# Altium schematic sheet Jetson_power.SchDoc
size A; SheetNumber: 3; SheetTotal: 3
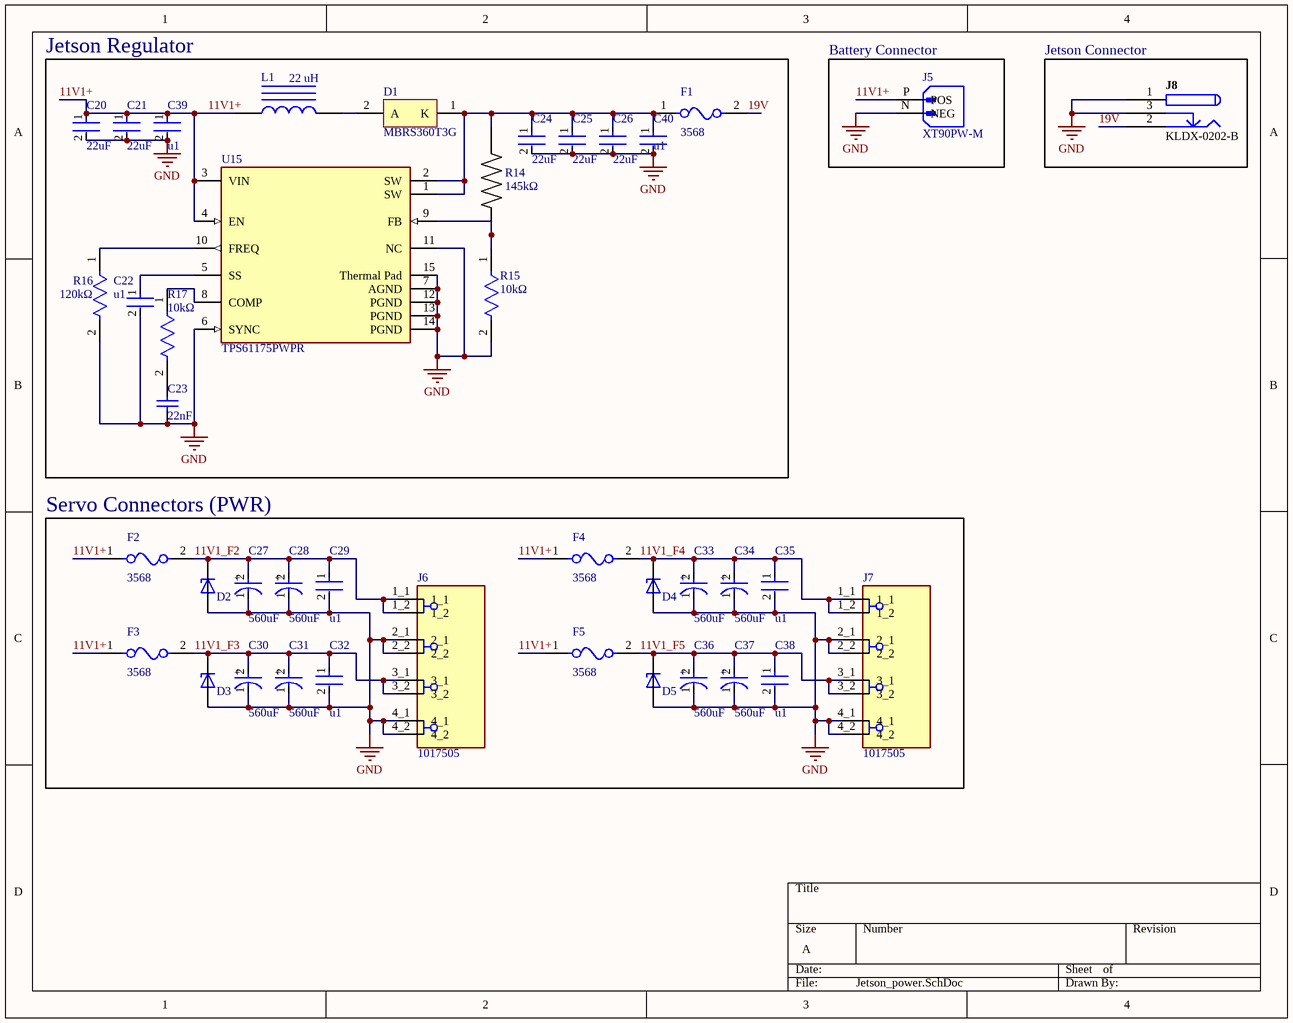
[diagram p0: Jetson_power.SchDoc]

## Parts
C20  22uF  [FP-CGA9P-MFG]
C21  22uF  [FP-CGA9P-MFG]
C22  u1  [FP-CC0805-0_85-MFG]
C23  22nF  [CAPC2013X94X50ML20T25]
C24  22uF  [FP-CGA9P-MFG]
C25  22uF  [FP-CGA9P-MFG]
C26  22uF  [FP-CGA9P-MFG]
C27  560uF  [FP-OS-CON-TH-E12-d_0_6-MFG]
C28  560uF  [FP-OS-CON-TH-E12-d_0_6-MFG]
C29  u1  [FP-CC0805-0_85-MFG]
C30  560uF  [FP-OS-CON-TH-E12-d_0_6-MFG]
C31  560uF  [FP-OS-CON-TH-E12-d_0_6-MFG]
C32  u1  [FP-CC0805-0_85-MFG]
C33  560uF  [FP-OS-CON-TH-E12-d_0_6-MFG]
C34  560uF  [FP-OS-CON-TH-E12-d_0_6-MFG]
C35  u1  [FP-CC0805-0_85-MFG]
C36  560uF  [FP-OS-CON-TH-E12-d_0_6-MFG]
C37  560uF  [FP-OS-CON-TH-E12-d_0_6-MFG]
C38  u1  [FP-CC0805-0_85-MFG]
C39  u1  [FP-CC0805-0_85-MFG]
C40  u1  [FP-CC0805-0_85-MFG]
D1  MBRS360T3G  [ONSC-SMC-2-403-03_V]
D2  SMBJ13A-13-F  [DIOM5336X250N]  (value not drawn)
D3  SMBJ13A-13-F  [DIOM5336X250N]  (value not drawn)
D4  SMBJ13A-13-F  [DIOM5336X250N]  (value not drawn)
D5  SMBJ13A-13-F  [DIOM5336X250N]  (value not drawn)
F1  3568  [FP-3568-MFG]
F2  3568  [FP-3568-MFG]
F3  3568  [FP-3568-MFG]
F4  3568  [FP-3568-MFG]
F5  3568  [FP-3568-MFG]
J5  XT90PW-M  [AMASS_XT90PW-M - duplicate]
J6  1017505  [PHOENIX_1017505]
J7  1017505  [PHOENIX_1017505]
J8  KLDX-0202-B  [KYCN-KLDX-0202-B_V]
L1  22 uH  [COIL-MSS1038_V]
R14  145kΩ  [*RESC2012X60N]
R15  10kΩ  [FP-RNCP0805-IPC_C]
R16  120kΩ  [FP-RMCF0603-IPC_A]
R17  10kΩ  [FP-RNCP0805-IPC_C]
U15  TPS61175PWPR  [FP-PWP0014E-MFG]

## Blocks framed on the sheet
Jetson Regulator: C20-C26 C39 C40 D1 F1 L1 R14-R17 U15
Battery Connector: J5
Jetson Connector: J8
Servo Connectors (PWR): C27-C38 D2-D5 F2-F5 J6 J7

## Nets
GND: C20.2 C21.2 C22.2 C23.1 C24.2 C25.2 C26.2 C27.1(C) C28.1(C) C29.2 C30.1(C) C31.1(C) C32.2 C33.1(C) C34.1(C) C35.2 C36.1(C) C37.1(C) C38.2 C39.2 C40.2 D2.2(A) D3.2(A) D4.2(A) D5.2(A) J5.N(NEG) J6.2_1 J6.2_2 J6.4_1 J6.4_2 J7.2_1 J7.2_2 J7.4_1 J7.4_2 J8.1 J8.3 R15.2 R16.2 U15.6(SYNC) U15.7(AGND) U15.11(NC) U15.12(PGND) U15.13(PGND) U15.14(PGND) U15.15(Thermal_Pad)
11V1+: C20.1 C21.1 C39.1 F2.1 F3.1 F4.1 F5.1 J5.P(POS) L1.1 U15.3(VIN) U15.4(EN)
11V1_F2: C27.2(A) C28.2(A) C29.1 D2.1(C) F2.2 J6.1_1 J6.1_2
11V1_F3: C30.2(A) C31.2(A) C32.1 D3.1(C) F3.2 J6.3_1 J6.3_2
11V1_F4: C33.2(A) C34.2(A) C35.1 D4.1(C) F4.2 J7.1_1 J7.1_2
11V1_F5: C36.2(A) C37.2(A) C38.1 D5.1(C) F5.2 J7.3_1 J7.3_2
19V: F1.2 J8.2
NetC22_1: C22.1 U15.5(SS)
NetC23_2: C23.2 R17.2
NetC24_1: C24.1 C25.1 C26.1 C40.1 D1.1(K) F1.1 R14.1 U15.1(SW) U15.2(SW)
NetD1_2: D1.2(A) L1.2
NetR14_2: R14.2 R15.1 U15.9(FB)
NetR16_1: R16.1 U15.10(FREQ)
NetR17_1: R17.1 U15.8(COMP)

## Notes on the sheet
- (in symbol CMP-05428-001250-1) +

## Library data of the parts
C20 C21 C24-C26 = CMP-08246-000043-1: CAP 2220 X7R 50V 22UF 20% 2.50MM CGA9P3X7R1H226M250KB
C22 C29 C32 C35 C38-C40 = CMP-2100-03606-3: CC0805KRX7R9BB104 CAP CER 0.1UF 50V X7R 0805; Manufacturer: Yageo; Tolerance: 0.1; Capacitance: 100 nF; Value: 100 nF; Material: Ceramic; Device Class L1: Passive Components; ComponentLink2Description: Datasheet; Package: CC0805-0.85; Manufacturer Part Number: CC0805KRX7R9BB104; Digikey Description: CAP CER 0.1UF 50V X7R 0805; Device Class L3: Ceramic Capacitors; Temperature: -30°C to +85°C; Temperature Characteristic: X7R; Voltage Rating: 50 V; Height: 0.95mm; RoHS: TRUE; Ipc Land Pattern Name: CAPC200125X85; Device Class L2: Capacitors; Category: Cap; Temperature Range Low: -30°C; Temperature Range High: +85°C; Mouser Description: Multilayer Ceramic Capacitors MLCC - SMD/SMT 100nF 50V X7R 10%; Footprint Url: http://www.yageo.com/exep/pages/download/literatures/UPY-C_GEN_24.pdf; Automotive: No; Octopart: https://octopart.com/cc0805krx7r9bb104-yageo-192993; Lead Free: Yes; ComponentLink2URL: http://www.yageo.com/documents/recent/UPY-GPHC_Y5V_6.3V-to-50V_8.pdf
C23 = CMP-2007-04398-1: 08055C223KAZ2A; Manufacturer: AVX Interconnect / Elco; Part Number: 08055C223KAZ2A
C27 C28 C30 C31 C33 C34 C36 C37 = CMP-05428-001250-1: Conductive Polymer Aluminum Solid Capacitors (OS-CON) 560uF ±20% 16V RADIAL TH 8x12mm 16SEPF560M; ESR (Equivalent Series Resistance): 14mR; Leakage Current: 1.792mA; Life (Hours): 5000Hour; Lead Diameter: 0.6mm; Dissipation Factor: 12%; Ripple Current: 4.95A; Polarity: Polar; RoHS Compliant: Yes; Length: 12mm; Series: OS-CON™, SEPF; Min Operating Temperature: -55°C; Construction: RADIAL; Tolerance: 20%; Capacitance: 560uF; Height: 12mm; Termination: Radial; Max Operating Temperature: 105°C; Number of Pins: 12; Diameter: 8mm; Lead Free: Lead Free; Lead Pitch: 3.5mm; Mount: Through Hole; Height - Seated (Max): 0.472inch; Package Quantity: 200; REACH SVHC: No SVHC; Voltage: 16V; Voltage Rating: 16V; Packaging: Bulk; Case/Package: Radial; Voltage Rating (DC): 16V
D1 = CMP-1055-00394-1: Schottky Power Rectifier, 2-Pin SMC, Pb-Free, Tape and Reel; Manufacturer: On Semiconductor; Configuration: Single; IFSM Max (A): 125; Packing: Tape and Reel; DatasheetVersion: Rev. 8; PackageReference: SMC-2-403-03; Mounting Technology: Surface Mount; ComponentLink2Description: Datasheet; ComponentLink2URL: http://www.onsemi.cn/pub_link/Collateral/MBRS360T3-D.PDF; PartNumber: MBRS360T3G; ComponentLink1Description: Manufacturer URL; ComponentLink3Description: Package Specification; PackageDescription: 2-Pin Small Molded Package, J-Bend Lead, Body 5.845 x 6.855 mm; ComponentLink1URL: http://www.onsemi.com/; PackageVersion: Rev. E, 08/2005; RoHS: TRUE; ComponentLink3URL: http://www.onsemi.com/pub_link/Collateral/403-03.PDF
D2-D5 = CMP-004-00032-1: 400 W 13 V Uni-Directional SMT Transient Voltage Suppressor Diode - DO-214AA; MF: Diodes Inc.; Component Type: Standard; Value: *; Case/Package: DO-214 Diodes Inc.; SnapEDA_Link: https://www.snapeda.com/parts/SMBJ13A-13-F/Diodes+Inc./view-part/?ref=snap; Check_prices: https://www.snapeda.com/parts/SMBJ13A-13-F/Diodes+Inc./view-part/?ref=eda; Design Item ID: SMBJ13A-13-F; Pins: 2; Source: SMBJ13A-13-F.SchLib; MP: SMBJ13A-13-F
F1-F5 = CMP-2000-05464-2: NexarPartId: 8116161; Approvals: UL; Body Material: Nylon; Illumination Type: Illuminated; Voltage Rating (AC): 500V; Current Rating: 20A; Number of Poles: 1; Color: Black; Material: Brass, Nylon, Tin; Depth: 6.73mm; Max Operating Temperature: 145°C; Length: 16mm; Mount: PCB, Vertical; REACH SVHC: No SVHC; Lead Free: Lead Free; Min Operating Temperature: -50°C; Flammability Rating: UL94 V-0; RoHS: Compliant; Orientation: Vertical; Fuse Current: 20A; Termination: PC Pin; Number of Circuits: 1; Contact Plating: Tin; Voltage: 500V; Contact Material: Brass
J5 = XT90PW-M: Socket; DC supply; XT90; male; PIN: 2; on PCBs; THT; Colour: yellow; MF: AMASS; SnapEDA_Link: https://www.snapeda.com/parts/XT90PW-M/AMASS/view-part/?ref=snap; Package: Package; Value: *; MP: XT90PW-M; Check_prices: https://www.snapeda.com/parts/XT90PW-M/AMASS/view-part/?ref=eda
J6 J7 = CMP-011-000000-2: MF: {'manufacturer': u'Phoenix Contact'}; Source: 1017505.SchLib; Price: None; MP: 1017505; Package: None; Component Type: Standard; Availability: Unavailable; Design Item ID: 1017505; Pin Count: 8; Value: *
J8 = CMP-0256-00001-1: 3 Conductor Power Jack, 2 break 2 aux contacts; ComponentLink2URL: http://anacapa.kycon.com/Catalog_PDF/KLDX_0202.pdf; PackageReference: KLDX-0202-B; Contact Finish: Brass; ComponentLink2Description: Datasheet; Mounting Technology: Through Hole; PackageDescription: Jack, 9 x 14.5 mm Body, 2.5 mm Center Pin Diameter; ComponentLink1Description: Manufacturer URL; PartNumber: KLDX-0202-B; ComponentLink1URL: http://kycon.com/
L1 = CMP-2000-06765-1: XAL7070; Case Length: 10.5mm; Shielding: Shielded; Maximum DC Resistance: 50mOhms; Core Material: Ferrite; Self Resonant Frequency: 21MHz; Tolerance: 20%; Test Frequency: 100kHz; Brand: Coilcraft; Case Height: 4mm; Maximum DC Current: 3.8A; Case Width: 10.2mm; Inductance: 15uH; Factory Pack Quantity: 250; Manufacturer URL: http://www.coilcraft.com/; Datasheet Version: 09/2016; Product: PowerInductors; Packaging: Reel; Product Category: FixedInductors; Package Description: 2-Pin Surface Mounted Device , Body 10 x 10 mm; RoHS: Details; Mounting Technology: SurfaceMount; Dimensions: 10.2mmWx10.5mmLx4mmH; Series: MSS1038; Termination Style: SMD/SMT; Datasheet URL: http://www.coilcraft.com/pdfs/mss1038.pdf; Manufacturer: Coilcraft; Package Reference: MSS1038; Operating Temperature Range: -40Cto+125C
R14 = RN73H2ATTD1453B25: SnapEDA_Link: https://www.snapeda.com/parts/RN73H2ATTD1453B25/KOA+Speer/view-part/?ref=snap; Check_prices: https://www.snapeda.com/parts/RN73H2ATTD1453B25/KOA+Speer/view-part/?ref=eda; Value: *
R15 R17 = CMP-26527-007436-1: 10kΩ ±1% 0.25W 0805 High Power Anti-Sulfur Thin Film Chip Resistor RNCP0805FTD10K0; Resistance: 10kR; Max Power Dissipation: 250mW; Temperature Coefficient: 100ppm/°C; Number of Terminations: 2; Length: 0.079inch; Case Code (Metric): 2012; Mount: Surface Mount; Resistor Type: Thin Film; Packaging: Tape and Reel; Tolerance: 1%; RoHS Compliant: Yes; Case Code (Imperial): 0805; Min Operating Temperature: -55°C; Max Operating Temperature: 155°C; Features: Moisture Resistant; Series: RNCP; Case/Package: 0805; Width: 0.049inch; Lead Free: Lead Free; Height: 0.024inch
R16 = CMP-26527-001149-1: 120kΩ ±1% 0.1W 0603 Thick Film Chip Resistor AEC-Q200 compliant RMCF0603FG120K; Resistance: 120kR; Temperature Coefficient: 100ppm/°C; Radiation Hardening: No; Tolerance: 1%; Mount: Surface Mount; Min Operating Temperature: -55°C; Max Operating Temperature: 155°C; Packaging: Tape and Reel; Contact Plating: Tin; Resistor Type: Thick Film; Case/Package: 0603
U15 = CMP-04918-000064-1: IC REG MULT CONFIG ADJ 14HTSSOP; Manufacturer: Texas Instruments; Switching Frequency: 200-2200kHz; Nominal Supply Current: 3.5mA; Max Junction Temp: +125°C; Standoff Height: 0.05mm; Output Voltage: 2.9-38V; Min Supply Voltage: 2.9V; Output Current: 3A; Max Duty Cycle: 93%; Number Of Outputs: 1; Max Supply Voltage: 18V; Switching Topology: Boost,Flyback,Other; Output Type: AdjustableProgrammable; Mouser Description: Voltage Regulators - Switching Regulators 3A High Vltg Boost Converter; ComponentLink2URL: http://www.ti.com/lit/ds/symlink/tps61175.pdf; Ambient Temperature Range High: +85°C; Category: IC; Temperature Range High: +85°C; Automotive: No; Digikey Description: IC REG MULT CONFIG ADJ 14HTSSOP; Ambient Temperature Range Low: -40°C; ComponentLink2Description: Datasheet; Octopart: https://octopart.com/tps61175pwpr-texas+instruments-12190773; Manufacturer Part Number: TPS61175PWPR; Ipc Land Pattern Name: SOP65P500X120-14; Package: PWP0014E; Height: 1.2mm; Device Class L3: Voltage Regulators - Switching; Device Class L2: Power Management ICs; Temperature Range Low: -40°C; Temperature: -40°C to +85°C; Device Class L1: Integrated Circuits (ICs); Lead Free: Yes; RoHS: TRUE